# EAGLE design akim_sensorleri (EAGLE 9.2.1)
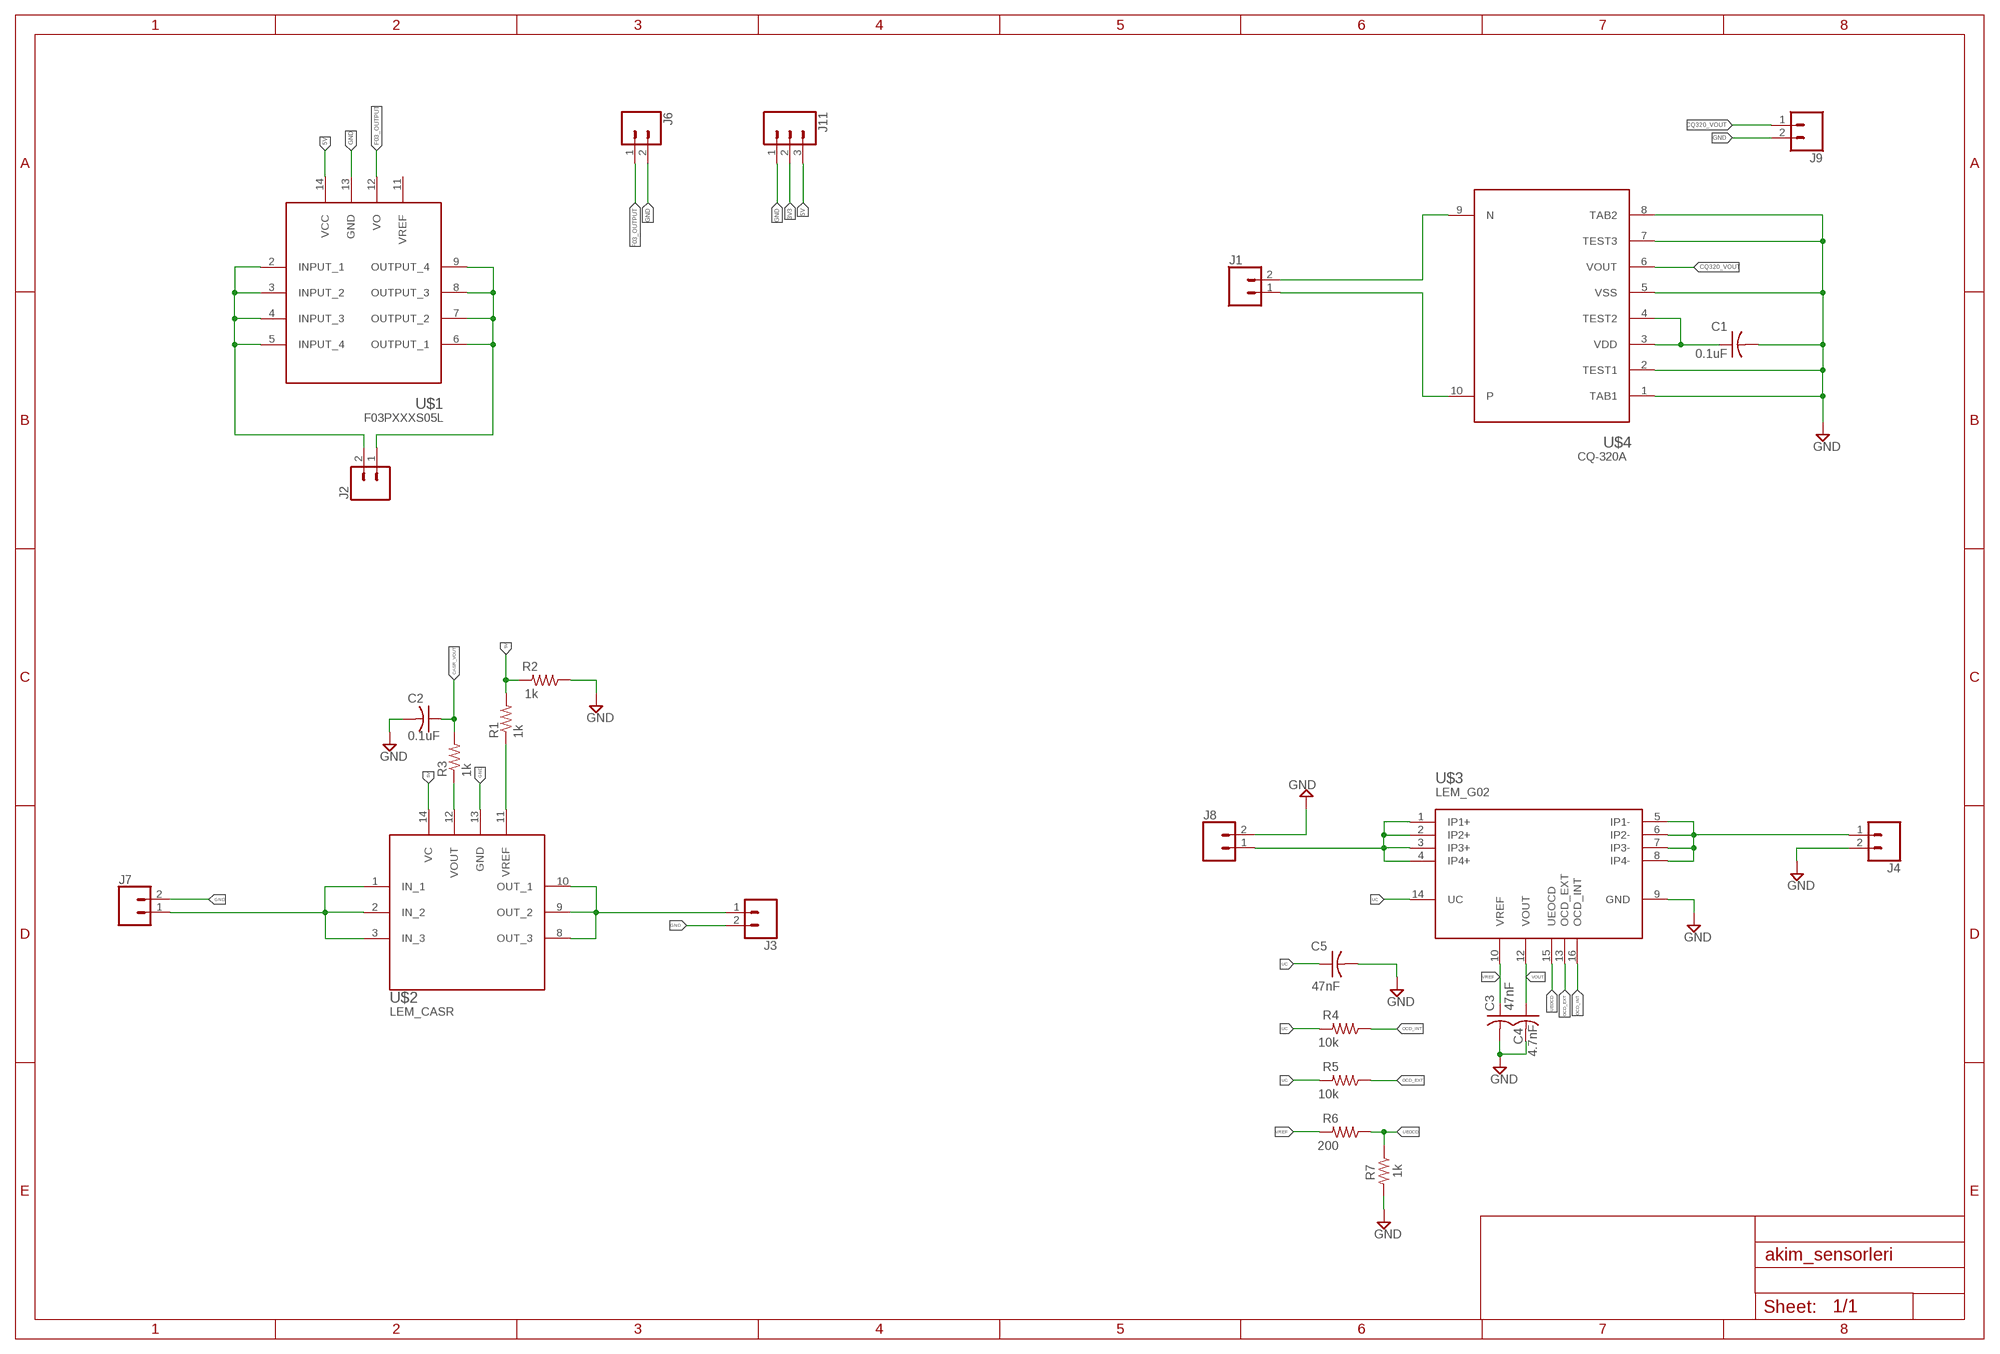
[diagram p0: schematic, sheet 1]

## Parts
C1  0.1uF  C-USC1206  [C1206]
C2  0.1uF  C-USC1206  [C1206]
C3  47nF  C-USC1206  [C1206]
C4  4.7nF  C-USC1206  [C1206]
C5  47nF  C-USC1206  [C1206]
J1  CONN_025MM  [SCREWTERMINAL-5MM-2]
J2  CONN_025MM  [SCREWTERMINAL-5MM-2]
J3  CONN_025MM  [SCREWTERMINAL-5MM-2]
J4  CONN_025MM  [SCREWTERMINAL-5MM-2]
J6  CONN_025MM  [SCREWTERMINAL-5MM-2]
J7  CONN_025MM  [SCREWTERMINAL-5MM-2]
J8  CONN_025MM  [SCREWTERMINAL-5MM-2]
J9  CONN_025MM  [SCREWTERMINAL-5MM-2]
J11  CONN_03-SCREW-5MM  [SCREWTERMINAL-5MM-3]
R1  1k  R-US_M1206  [M1206]
R2  1k  R-US_M1206  [M1206]
R3  1k  R-US_M1206  [M1206]
R4  10k  R-US_M1206  [M1206]
R5  10k  R-US_M1206  [M1206]
R6  200  R-US_M1206  [M1206]
R7  1k  R-US_M1206  [M1206]
U$1  F03PXXXS05L  [F03PXXXS05L]
U$2  LEM_CASR  [LEM]
U$3  LEM_G02  [LEM_G02]
U$4  CQ-320A  [CQ-320A]

## Nets
3V3: J11.2
5V: J11.3 R1.2 R2.2 U$1.14(VCC) U$2.14(VC)
CASR_VOUT: C2.1 R3.2
CQ320_VOUT: J9.1 U$4.6(VOUT)
F03_OUTPUT: J6.1 U$1.12(VO)
GND: C1.2 C2.2 C3.2 C4.2 C5.2 J3.2 J4.2 J6.2 J7.2 J8.2 J9.2 J11.1 R2.1 R7.2 U$1.13(GND) U$2.13(GND) U$3.9(GND) U$4.1(TAB1) U$4.2(TEST1) U$4.5(VSS) U$4.7(TEST3) U$4.8(TAB2)
N$1: J1.2 U$4.9(N)
N$2: J1.1 U$4.10(P)
N$5: R3.1 U$2.12(VOUT)
N$6: J4.1 U$3.5(IP1-) U$3.6(IP2-) U$3.7(IP3-) U$3.8(IP4-)
N$7: R1.1 U$2.11(VREF)
N$8: J7.1 U$2.1(IN_1) U$2.2(IN_2) U$2.3(IN_3)
N$9: J8.1 U$3.1(IP1+) U$3.2(IP2+) U$3.3(IP3+) U$3.4(IP4+)
N$10: J3.1 U$2.8(OUT_3) U$2.9(OUT_2) U$2.10(OUT_1)
N$11: J2.2 U$1.2(INPUT_1) U$1.3(INPUT_2) U$1.4(INPUT_3) U$1.5(INPUT_4)
N$13: J2.1 U$1.6(OUTPUT_1) U$1.7(OUTPUT_2) U$1.8(OUTPUT_3) U$1.9(OUTPUT_4)
N$16: C1.1 U$4.3(VDD) U$4.4(TEST2)
OCD_EXT: R5.1 U$3.13(OCD_EXT)
OCD_INT: R4.1 U$3.16(OCD_INT)
UC: C5.1 R4.2 R5.2 U$3.14(UC)
UEOCD: R6.1 R7.1 U$3.15(UEOCD)
VOUT: C4.1 U$3.12(VOUT)
VREF: C3.1 R6.2 U$3.10(VREF)
Unconnected: U$1.11(VREF)

## Library data of the parts
C1-C5 = adafruit:C-US: CAPACITOR, American symbol
J1-J4 J6-J9 = SparkFun-Connectors:CONN_02: Multi connection point. Often used as Generic Header-pin footprint for 0.1 inch spaced/style header connections On any of the 0.1 inch spaced packages, you can populate with these: Break Away Headers - Straight <https://www.sparkfun.com/products/116> (PRT-00116) Break Away Male Headers - Right Angle <https://www.sparkfun.com/products/553> (PRT-00553) Female Headers <https://www.sparkfun.com/products/115> (PRT-00115) Break Away Headers - Machine Pin <https://www.sparkfun.com/products/117> (PRT-00117) Break Away Female Headers - Swiss Machine Pin <https://www.sparkfun.com/products/743> (PRT-00743) For SCREWTERMINALS and SPRING TERMINALS visit here: Screw Terimnals on SparkFun.com <https://www.sparkfun.com/search/results?term=Screw+Terminals> (5mm/3.5mm/2.54mm spacing) This device is also useful as a general connection point to wire up your design to another part of your project. Our various solder wires solder well into these plated through hole pads. Hook-Up Wire - Assortment (Stranded, 22 AWG) <https://www.sparkfun.com/products/11375> (PRT-11375) Hook-Up Wire - Assortment (Solid Core, 22 AWG) <https://www.sparkfun.com/products/11367> (PRT-11367) View the entire wire category on our website here <https://www.sparkfun.com/categories/141> Special notes: Molex polarized connector foot print use with: PRT-08233 with associated crimp pins and housings. 2.54_SCREWTERM for use with PRT-10571. 3.5mm Screw Terminal footprints for PRT-08084 5mm Screw Terminal footprints for use with PRT-08432; SF_SKU: PRT-08432
J11 = SparkFun-Connectors:CONN_03: Multi connection point. Often used as Generic Header-pin footprint for 0.1 inch spaced/style header connections On any of the 0.1 inch spaced packages, you can populate with these: Break Away Headers - Straight <https://www.sparkfun.com/products/116> (PRT-00116) Break Away Male Headers - Right Angle <https://www.sparkfun.com/products/553> (PRT-00553) Female Headers <https://www.sparkfun.com/products/115> (PRT-00115) Break Away Headers - Machine Pin <https://www.sparkfun.com/products/117> (PRT-00117) Break Away Female Headers - Swiss Machine Pin <https://www.sparkfun.com/products/743> (PRT-00743) Stackable Header - 3 Pin (Female, 0.1") <https://www.sparkfun.com/products/13875> (PRT-13875) For SCREWTERMINALS and SPRING TERMINALS visit here: Screw Terimnals on SparkFun.com <https://www.sparkfun.com/search/results?term=Screw+Terminals> (5mm/3.5mm/2.54mm spacing) This device is also useful as a general connection point to wire up your design to another part of your project. Our various solder wires solder well into these plated through hole pads. Hook-Up Wire - Assortment (Stranded, 22 AWG) <https://www.sparkfun.com/products/11375> (PRT-11375) Hook-Up Wire - Assortment (Solid Core, 22 AWG) <https://www.sparkfun.com/products/11367> (PRT-11367) View the entire wire category on our website here <https://www.sparkfun.com/categories/141> Special notes: Molex polarized connector foot print use with SKU : PRT-08232 with associated crimp pins and housings.; PROD_ID: CONN-10134; SF_SKU: PRT-08433
R1-R7 = adafruit:R-US_: RESISTOR, American symbol
U$1 = F03PXXXS05L:F03PXXXS05L
U$2 = LEMCASR 15-NP:LEM_CASR
U$3 = LEM G02:LEM_G02
U$4 = herenkeskin:CQ-320A

## Board
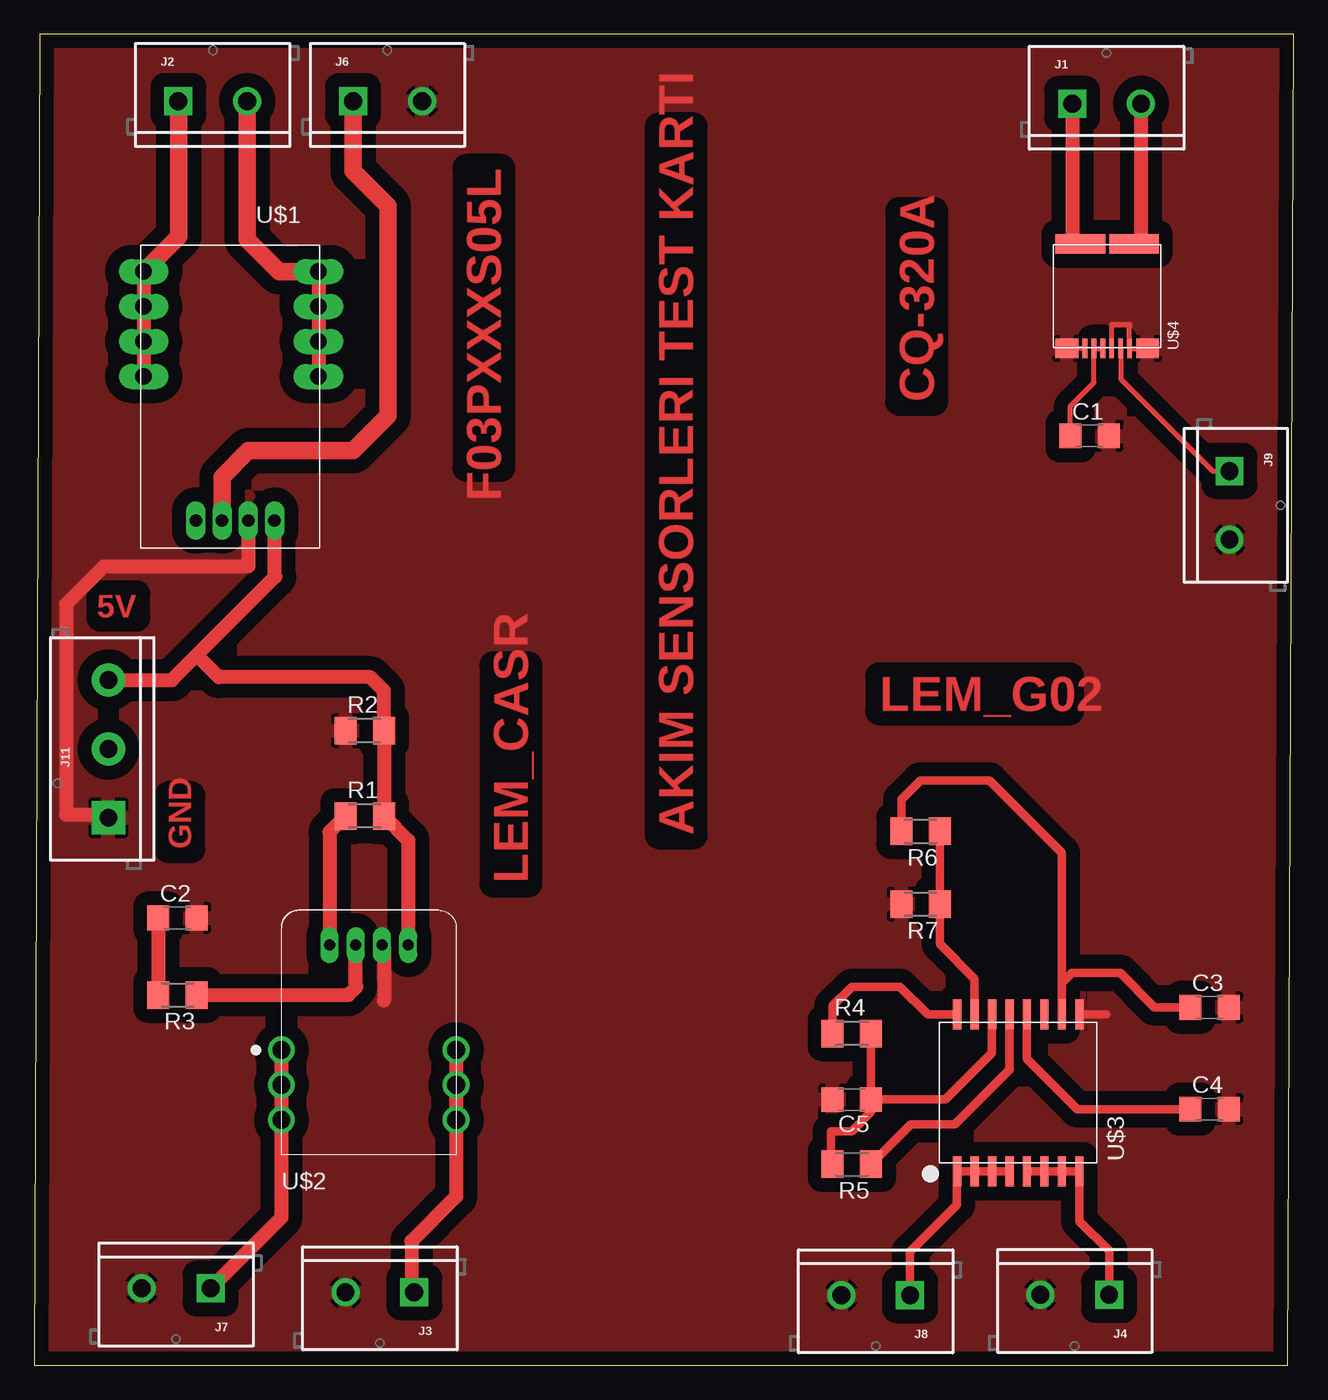
[diagram p1: board, top side]

Size 91.5 x 96.7 mm. Coordinates in mm from the lower left corner, seen from the top.
Outline: 0,0 91.1,0 91.5,96.7 0.4,96.7 0,0
Copper layers (1*16): Top 0.035mm / dielectric 1.5mm / Bottom 0.035mm
Design rules "default": minimum track width 6mil, minimum drill 0.35mm, track to track 6mil, track to pad 6mil, pad to pad 6mil, via to via 6mil, smd to smd 6mil, copper to edge 40mil, drill to drill 6mil, minimum pad ring 10mil, minimum via ring 8mil, stop-mask expansion 4mil, vias tented up to drill 0mil, thermal gap 10mil

### Footprints (pad centres in the part's own frame; a part is rotated, then mirrored left to right if it is on the bottom)
C1206 = smd 1.6 x 1.8: 1 -1.4,0; 2 1.4,0
SCREWTERMINAL-5MM-2 = drill 1.3 pad 2.032 square: 1 0,0 | drill 1.3 pad 2.032: 2 5,0
SCREWTERMINAL-5MM-3 = drill 1.3 pad 2.413 square: 1 0,0 | drill 1.3 pad 2.413: 2 5,0; 3 10,0
M1206 = smd 1.6 x 2: 1 -1.4,0; 2 1.4,0
F03PXXXS05L = drill 1.2 long: 2 1.58,-6.37; 3 4.12,-6.37; 4 6.66,-6.37; 5 9.2,-6.37; 6 9.2,6.33; 7 6.66,6.33; 8 4.12,6.33; 9 1.58,6.33 | drill 0.9 long: 11 -8.89,2.54; 12 -8.89,0.635; 13 -8.89,-1.27; 14 -8.89,-3.175
LEM = drill 1.3 pad 1.9: 1 -6.35,0; 2 -6.35,-2.54; 3 -6.35,-5.08; 8 6.35,-5.08; 9 6.35,-2.54; 10 6.35,0 | drill 0.8 pad 1.3 long: 11 -2.857,7.62; 12 -0.953,7.62 | drill 0.8 long: 13 0.953,7.62; 14 2.857,7.62
LEM_G02 = smd 2.2 x 0.6: 1 -5.82,4.55; 2 -5.82,3.28; 3 -5.82,2.01; 4 -5.82,0.74; 5 -5.82,-0.53; 6 -5.82,-1.8; 7 -5.82,-3.07; 8 -5.82,-4.34; 9 5.58,-4.34; 10 5.58,-3.07; 11 5.58,-1.8; 12 5.58,-0.53; 13 5.58,0.74; 14 5.58,2.01; 15 5.58,3.28; 16 5.58,4.55
CQ-320A = smd 1.65 x 1.42: 1 -2.925,-3.81; 8 2.925,-3.81 | smd 0.35 x 1.42: 2 -1.625,-3.81; 3 -0.975,-3.81; 4 -0.325,-3.81; 5 0.325,-3.81; 6 0.975,-3.81; 7 1.625,-3.81 | smd 3.6 x 1.42: 9 1.95,3.81; 10 -1.95,3.81

### Placement (x,y rotation side)
C1  76.69,67.52 0 top
C2  10.4,32.5 0 top
C3  85.4,26 0 top
C4  85.4,18.6 0 top
C5  59.4,19.3 180 top
J1  75.42,91.65 0 top
J2  10.46,91.85 0 top
J3  27.6,5.3 180 top
J4  78.1,5.1 180 top
J6  23.16,91.85 0 top
J7  12.8,5.58 180 top
J8  63.64,5.08 180 top
J9  86.85,64.98 270 top
J11  5.38,39.78 90 top
R1  24,39.9 0 top
R2  24,46.1 0 top
R3  10.4,26.9 180 top
R4  59.4,24.1 0 top
R5  59.4,14.6 180 top
R6  64.4,38.8 180 top
R7  64.4,33.5 180 top
U$1  14.27,70.26 90 top
U$2  24.3,22.9 0 top
U$3  71.6,19.9 90 top
U$4  77.96,77.68 0 top

### Tracks (layer width: path | path; a pad name or v marks a point on that pad's centre or on a via)
5V
  Top 1.016: J11.3 9.98,49.78 11.8,51.6 | 11.8,51.6 17.5,57.3 17.45,57.35 U$1.14 | 11.8,51.6 13.4,50 24.4,50 25.4,49 R2.2 R1.2 27.16,38.14 U$2.14
CASR_VOUT
  Top 1.016: C2.1 R3.2
CQ320_VOUT
  Top 0.35: U$4.6 78.94,71.67 85.62,64.98 J9.1
F03_OUTPUT
  Top 1.27: J6.1 23.16,86.77 25.7,84.23 25.7,68.99 23.16,66.45 15.54,66.45 13.63,64.55 U$1.12
GND
  Top 0.35: U$4.2 U$4.1 | U$4.5 78.29,75.58 | 79.59,75.4 U$4.7 U$4.8
  Top 0.406: 78.29,75.58 78.3,75.6 79.6,75.6 79.59,75.58 79.59,75.4
  Top 0.61: U$3.9 75.96,25.5 77.9,25.5
  Top 1.016: U$1.13 15.54,58.04 5.04,58.04 2.3,55.3 2.3,40 5.16,40 J11.1 | U$2.13 25.4,30.37 25.4,26.5
  pour Top (isolate 1.016): -4.1,102.1 98.9,102.1 98.9,-1.5 98.6,-1.8 -4.6,-1.8 -5.1,-1.3 -5.1,101.3 -4.1,102.3
N$1
  Top 1.016: J1.2 80.42,82 U$4.9
N$2
  Top 1.016: J1.1 75.42,82.08 U$4.10
N$5
  Top 1.016: R3.1 22.8,26.9 23.4,27.5 23.35,27.55 U$2.12
N$6
  Top 0.61: U$3.5 U$3.6 U$3.7 U$3.8 75.94,10.46 78.1,8.3 J4.1
N$7
  Top 1.016: R1.1 21.44,38.74 U$2.11
N$8
  Top 1.016: J7.1 17.95,10.73 U$2.3 U$2.2 U$2.1
N$9
  Top 0.61: J8.1 63.64,8.24 67.05,11.65 U$3.1 U$3.2 U$3.3 U$3.4
N$10
  Top 1.016: U$2.10 U$2.9 U$2.8 30.65,12.25 27.4,9 27.4,5.5 J3.1
N$11
  Top 1.016: U$1.5 U$1.4 U$1.3 U$1.2
  Top 1.27: J2.2 15.46,81.77 17.77,79.46 U$1.5
N$13
  Top 1.016: U$1.6 U$1.7 U$1.8 U$1.9
  Top 1.27: J2.1 10.48,91.83 10.48,82 U$1.6
N$16
  Top 0.35: C1.1 75.29,69.69 77,71.4 77,73.86 U$4.3 U$4.4
OCD_EXT
  Top 0.61: R5.1 63.7,17.5 66.9,17.5 70.9,21.5 70.86,21.54 U$3.13
OCD_INT
  Top 0.61: U$3.16 64.92,25.48 62.9,27.5 59.4,27.5 58,26.1 R4.1
UC
  Top 0.61: U$3.14 69.59,22.69 66.2,19.3 C5.1 | R4.2 C5.1 | C5.1 60.8,18.4 59.4,17 57.9,17 57.9,14.7 R5.2
UEOCD
  Top 0.61: R6.1 R7.1 65.8,30.6 68.32,28.08 U$3.15
VOUT
  Top 0.61: U$3.12 72.13,22.27 75.8,18.6 C4.1
VREF
  Top 0.61: U$3.10 74.67,27.77 | 74.67,27.77 75.4,28.5 78.9,28.5 81.4,26 C3.1 | 74.67,27.77 74.67,37.23 69.4,42.5 64.4,42.5 63,41.1 R6.2

### Text on the board
Top: F03PXXXS05L | CQ-320A | 5V | LEM_G02 | GND | AKIM SENSORLERI TEST KARTI | LEM_CASR